# Altium schematic sheet 0_STM32_Tutorial-Overview.SchDoc
size A4; SheetNumber: 1; SheetTotal: 4
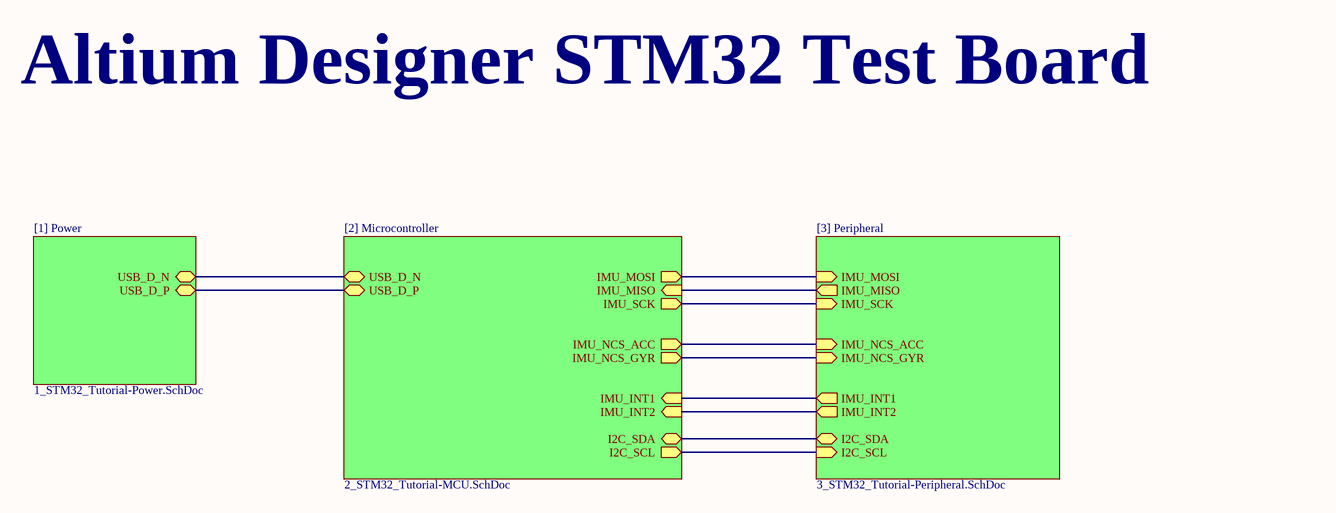
[diagram p0: 0_STM32_Tutorial-Overview.SchDoc]

## Sub-sheets
[1] Power = 1_STM32_Tutorial-Power.SchDoc: USB_D_N (bidir), USB_D_P (bidir)
[2] Microcontroller = 2_STM32_Tutorial-MCU.SchDoc: USB_D_N (bidir), USB_D_P (bidir), IMU_NCS_GYR (out), IMU_NCS_ACC (out), IMU_SCK (out), IMU_MISO (in), IMU_MOSI (out), I2C_SCL (out), I2C_SDA (bidir), IMU_INT1 (in), IMU_INT2 (in)
[3] Peripheral = 3_STM32_Tutorial-Peripheral.SchDoc: IMU_SCK (in), IMU_MOSI (in), IMU_MISO (out), IMU_NCS_GYR (in), IMU_NCS_ACC (in), IMU_INT1 (out), IMU_INT2 (out), I2C_SCL (in), I2C_SDA (bidir)

## Nets
(unnamed): sheet [1] Power/USB_D_N, sheet [2] Microcontroller/USB_D_N
(unnamed): sheet [1] Power/USB_D_P, sheet [2] Microcontroller/USB_D_P
(unnamed): sheet [2] Microcontroller/IMU_NCS_GYR, sheet [3] Peripheral/IMU_NCS_GYR
(unnamed): sheet [2] Microcontroller/IMU_NCS_ACC, sheet [3] Peripheral/IMU_NCS_ACC
(unnamed): sheet [2] Microcontroller/IMU_SCK, sheet [3] Peripheral/IMU_SCK
(unnamed): sheet [2] Microcontroller/IMU_MISO, sheet [3] Peripheral/IMU_MISO
(unnamed): sheet [2] Microcontroller/IMU_MOSI, sheet [3] Peripheral/IMU_MOSI
(unnamed): sheet [2] Microcontroller/I2C_SCL, sheet [3] Peripheral/I2C_SCL
(unnamed): sheet [2] Microcontroller/I2C_SDA, sheet [3] Peripheral/I2C_SDA
(unnamed): sheet [2] Microcontroller/IMU_INT1, sheet [3] Peripheral/IMU_INT1
(unnamed): sheet [2] Microcontroller/IMU_INT2, sheet [3] Peripheral/IMU_INT2

## Notes on the sheet
- Altium Designer STM32 Test Board